# Altium project DC_ESC.PrjPcb
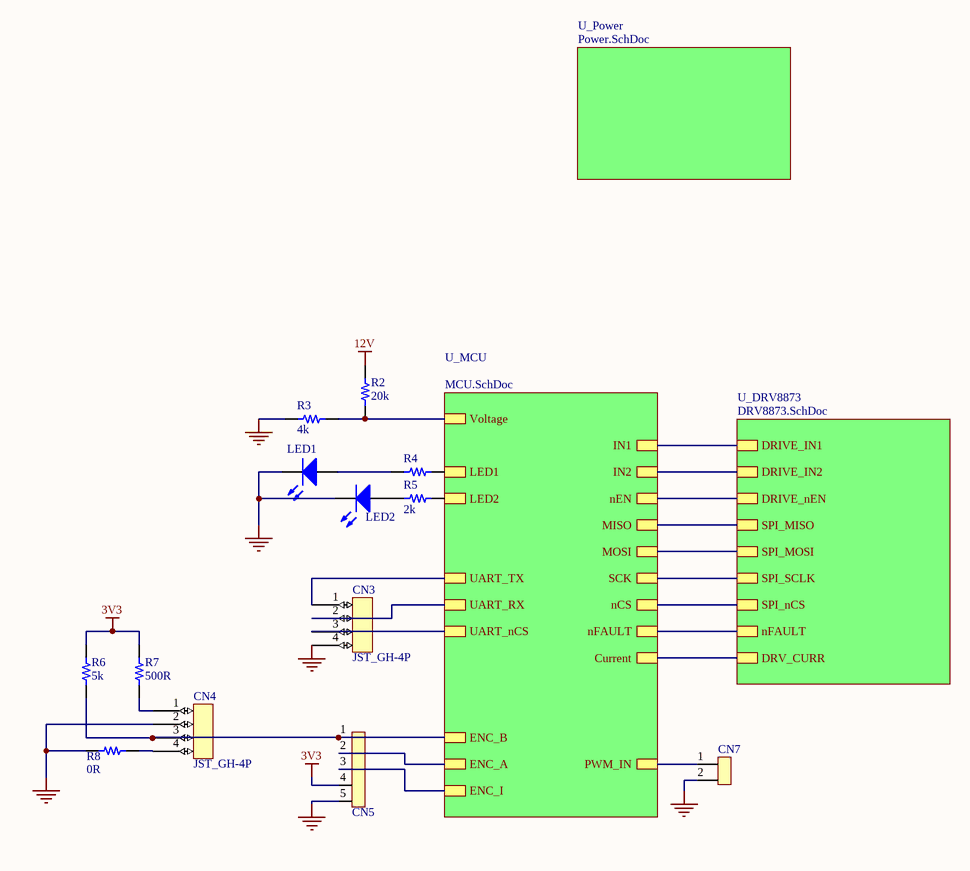
[diagram p0: ESC.SchDoc]
4 sheets, 34 parts. Net scope: hierarchical (ports join the sheet entries above them; power ports are global).
Board file: ESC.PcbDoc
Sheets:
  ESC.SchDoc
    U_MCU = MCU.SchDoc
    U_DRV8873 = DRV8873.SchDoc
    U_Power = Power.SchDoc

## Sheet ESC.SchDoc
size A3

### Parts
CN3  JST_GH-4P  [JST_GH-4P]
CN4  JST_GH-4P  [JST_GH-4P]
CN5  5P-2.5mm  [5-Pin-Header]  (value not drawn)
CN7  2P-2.5mm  [2.5mm-2P]  (value not drawn)
LED1  LED  [0805-LED]  (value not drawn)
LED2  LED  [0805-LED]  (value not drawn)
R2  20k  [0805 - duplicate]
R3  4k  [0805 - duplicate]
R4  4k  [0805 - duplicate]  (value not drawn)
R5  2k  [0805 - duplicate]
R6  5k  [0805 - duplicate]
R7  500R  [0805 - duplicate]
R8  0R  [0805 - duplicate]

### Sub-sheets
U_DRV8873 = DRV8873.SchDoc: DRIVE_IN1, DRIVE_IN2, DRIVE_nEN, SPI_MISO, SPI_MOSI, SPI_SCLK, SPI_nCS, nFAULT, DRV_CURR
U_MCU = MCU.SchDoc: LED1, LED2, MOSI, MISO, SCK, nCS, nEN, nFAULT, IN2, IN1, Voltage, Current, UART_TX, UART_RX, UART_nCS, ENC_B, ENC_A, ENC_I, PWM_IN
U_Power = Power.SchDoc: no entries

### Nets
3V3: CN5.4 R6.1 R7.1
12V: R2.2
GND: CN3.4 CN4.2 CN5.5 CN7.2 LED1.2(K) LED2.2(K) R3.2 R8.1
NetCN3_1: CN3.1 ; sheet U_MCU/UART_TX
NetCN3_2: CN3.2 ; sheet U_MCU/UART_RX
NetCN3_3: CN3.3 ; sheet U_MCU/UART_nCS
NetCN4_1: CN4.1 R7.2
NetCN4_3: CN4.3 CN5.1 R6.2 ; sheet U_MCU/ENC_B
NetCN4_4: CN4.4 R8.2
NetCN5_2: CN5.2 ; sheet U_MCU/ENC_A
NetCN5_3: CN5.3 ; sheet U_MCU/ENC_I
NetCN7_1: CN7.1 ; sheet U_MCU/PWM_IN
NetLED1_1: LED1.1(A) R4.2
NetLED2_1: LED2.1(A) R5.2
NetR2_1: R2.1 R3.1 ; sheet U_MCU/Voltage
NetR4_1: R4.1 ; sheet U_MCU/LED1
NetR5_1: R5.1 ; sheet U_MCU/LED2
NetR9_2: sheet U_MCU/Current, sheet U_DRV8873/DRV_CURR
NetU1_18: sheet U_MCU/IN1, sheet U_DRV8873/DRIVE_IN1
NetU1_19: sheet U_MCU/IN2, sheet U_DRV8873/DRIVE_IN2
NetU1_20: sheet U_MCU/nEN, sheet U_DRV8873/DRIVE_nEN
NetU1_21: sheet U_MCU/nFAULT, sheet U_DRV8873/nFAULT
NetU1_25: sheet U_MCU/nCS, sheet U_DRV8873/SPI_nCS
NetU1_26: sheet U_MCU/SCK, sheet U_DRV8873/SPI_SCLK
NetU1_27: sheet U_MCU/MISO, sheet U_DRV8873/SPI_MISO
NetU1_28: sheet U_MCU/MOSI, sheet U_DRV8873/SPI_MOSI

### Library data of the parts
R2-R8 = Resistor

## Sheet MCU.SchDoc
size A4
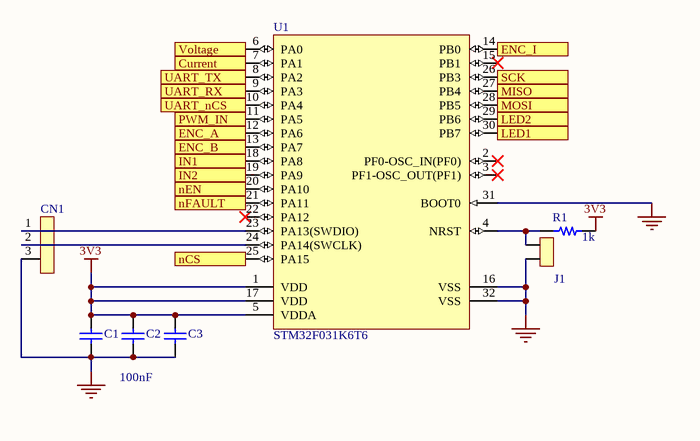
[diagram p1: MCU.SchDoc]

### Parts
C1  Cap  [0402]  (value not drawn)
C2  value 100nF  [0402]  (hidden comment: Cap)
C3  Cap  [0402]  (value not drawn)
CN1  3P-2.5mm  [2.5mm-3P]  (value not drawn)
J1  Jumper  [Jumper]  (value not drawn)
R1  1k  [0805 - duplicate]
U1  STM32F031K6T6  [STM-LQFP32_N]

### Ports
Current, ENC_A, ENC_B, ENC_I, IN1, IN2, LED1, LED2, MISO, MOSI, nCS, nEN, nFAULT, PWM_IN, SCK, UART_nCS, UART_RX, UART_TX, Voltage

### Nets
3V3: C1.2 C2.2 C3.2 R1.2 U1.1(VDD) U1.5(VDDA) U1.17(VDD)
GND: C1.1 C2.1 C3.1 CN1.3 J1.2 U1.16(VSS) U1.31(BOOT0) U1.32(VSS)
NetCN1_1: CN1.1 U1.23(PA13(SWDIO))
NetCN1_2: CN1.2 U1.24(PA14(SWCLK))
NetCN3_1: U1.8(PA2) ; port UART_TX
NetCN3_2: U1.9(PA3) ; port UART_RX
NetCN3_3: U1.10(PA4) ; port UART_nCS
NetCN4_3: U1.13(PA7) ; port ENC_B
NetCN5_2: U1.12(PA6) ; port ENC_A
NetCN5_3: U1.14(PB0) ; port ENC_I
NetCN7_1: U1.11(PA5) ; port PWM_IN
NetJ1_1: J1.1 R1.1 U1.4(NRST)
NetR2_1: U1.6(PA0) ; port Voltage
NetR4_1: U1.30(PB7) ; port LED1
NetR5_1: U1.29(PB6) ; port LED2
NetR9_2: U1.7(PA1) ; port Current
NetU1_18: U1.18(PA8) ; port IN1
NetU1_19: U1.19(PA9) ; port IN2
NetU1_20: U1.20(PA10) ; port nEN
NetU1_21: U1.21(PA11) ; port nFAULT
NetU1_25: U1.25(PA15) ; port nCS
NetU1_26: U1.26(PB3) ; port SCK
NetU1_27: U1.27(PB4) ; port MISO
NetU1_28: U1.28(PB5) ; port MOSI

Not connected (* = marked no-connect by the designer): U1 2(PF0-OSC_IN(PF0))* 3(PF1-OSC_OUT(PF1))* 15(PB1)* 22(PA12)*

### Library data of the parts
C1 C3 = Cap: Value: 100pF; Published: 8-Jun-2000; LatestRevisionDate: 17-Jul-2002; LatestRevisionNote: Re-released for DXP Platform.; PackageReference: RAD-0.3; Publisher: Altium Limited; PackageDescription: Radial Cap, Thru-Hole; 2 Leads; 0.3 in Pin Spacing
R1 = Resistor
U1 = CMP-0304-00091-2: ARM Cortex-M0 32-bit MCU, 32 KB Flash, 4 KB Internal RAM, 25 I/Os, 32-Pin LQFP, -40 to 85 degC, Tray; Manufacturer: STMicroelectronics; Operating Frequency(F) (Processor speed) (MHz): 48; Supply Voltage(Vcc) min (V): 2; Internal RAM Size (kB): 4; I/Os (High Current): 25; FLASH Size (Prog) (kB): 32; Package Description: 32-Pin Low Profile Quad Flat Package, 7 x 7 mm Body, 0.8 mm Pitch; Packing: Tray; Package Reference: LQFP32; ComponentLink2URL: http://www.st.com/st-web-ui/static/active/en/resource/technical/document/datasheet/DM00104043.pdf; ComponentLink2Description: Datasheet; ComponentLink1Description: Manufacturer URL; PartNumber: STM32F031K6T6; ComponentLink1URL: http://www.st.com/; Mounting Technology: Surface Mount; DatasheetVersion: Rev. 3; Core: ARM Cortex-M0
C2 = Cap: Published: 8-Jun-2000; LatestRevisionDate: 17-Jul-2002; LatestRevisionNote: Re-released for DXP Platform.; PackageReference: RAD-0.3; Publisher: Altium Limited; PackageDescription: Radial Cap, Thru-Hole; 2 Leads; 0.3 in Pin Spacing

## Sheet DRV8873.SchDoc
size A3
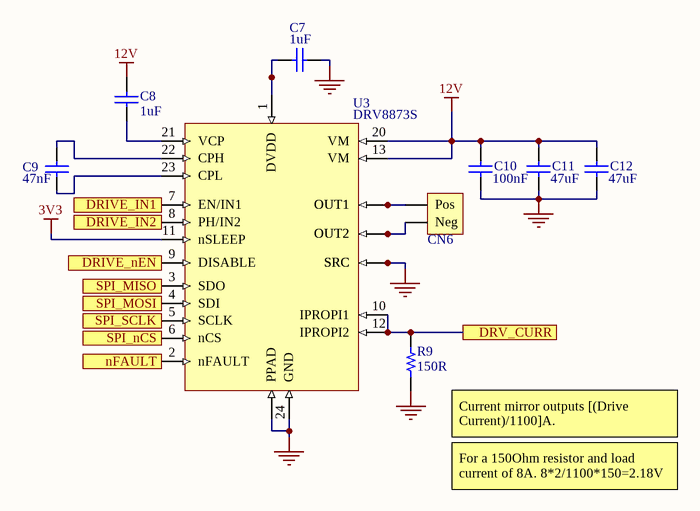
[diagram p2: DRV8873.SchDoc]

### Parts
C7  value 1uF  [0402]  (hidden comment: Cap)
C8  value 1uF  [0402]  (hidden comment: Cap)
C9  value 47nF  [0402]  (hidden comment: Cap)
C10  value 100nF  [0402]  (hidden comment: Cap)
C11  value 47uF  [1206]  (hidden comment: Cap)
C12  value 47uF  [1206]  (hidden comment: Cap)
CN6  JST_Leads_In  [Power_Leads]  (value not drawn)
R9  150R  [0805 - duplicate]
U3  DRV8873S  [HTSSOP24]

### Ports
DRIVE_IN1, DRIVE_IN2, DRIVE_nEN, DRV_CURR, nFAULT, SPI_MISO, SPI_MOSI, SPI_nCS, SPI_SCLK

### Nets
3V3: U3.11(nSLEEP)
12V: C8.2 C10.2 C11.2 C12.2 U3.13(VM) U3.20(VM)
GND: C7.2 C10.1 C11.1 C12.1 R9.1 U3.16(SRC) U3.17(SRC) U3.24(GND) U3.THERM(PPAD)
NetC7_1: C7.1 U3.1(DVDD)
NetC8_1: C8.1 U3.21(VCP)
NetC9_1: C9.1 U3.23(CPL)
NetC9_2: C9.2 U3.22(CPH)
NetCN6_A: CN6.A(Pos) U3.18(OUT1) U3.19(OUT1)
NetCN6_K: CN6.K(Neg) U3.14(OUT2) U3.15(OUT2)
NetR9_2: R9.2 U3.10(IPROPI1) U3.12(IPROPI2) ; port DRV_CURR
NetU1_18: U3.7(EN/IN1) ; port DRIVE_IN1
NetU1_19: U3.8(PH/IN2) ; port DRIVE_IN2
NetU1_20: U3.9(DISABLE) ; port DRIVE_nEN
NetU1_21: U3.2(nFAULT) ; port nFAULT
NetU1_25: U3.6(nCS) ; port SPI_nCS
NetU1_26: U3.5(SCLK) ; port SPI_SCLK
NetU1_27: U3.3(SDO) ; port SPI_MISO
NetU1_28: U3.4(SDI) ; port SPI_MOSI

### Notes on the sheet
- (near R9) Current mirror outputs [(Drive Current)/1100]A.
- For a 150Ohm resistor and load current of 8A. 8*2/1100*150=2.18V

### Library data of the parts
R9 = Resistor
C7-C12 = Cap: Published: 8-Jun-2000; LatestRevisionDate: 17-Jul-2002; LatestRevisionNote: Re-released for DXP Platform.; PackageReference: RAD-0.3; Publisher: Altium Limited; PackageDescription: Radial Cap, Thru-Hole; 2 Leads; 0.3 in Pin Spacing

## Sheet Power.SchDoc
size A4
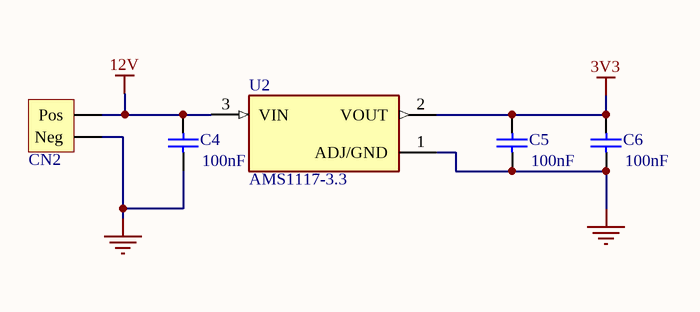
[diagram p3: Power.SchDoc]

### Parts
C4  value 100nF  [0402]  (hidden comment: Cap)
C5  value 100nF  [0402]  (hidden comment: Cap)
C6  value 100nF  [0402]  (hidden comment: Cap)
CN2  JST_Leads_In  [Power_Leads]  (value not drawn)
U2  AMS1117-3.3  [SOT229P700X180-4N]

### Nets
3V3: C5.2 C6.2 U2.2(VOUT)
12V: C4.2 CN2.A(Pos) U2.3(VIN)
GND: C4.1 C5.1 C6.1 CN2.K(Neg) U2.1(ADJ/GND)

### Library data of the parts
U2 = AMS1117-3.3: Sot223/Pkg 1-Amp 3.3-Volt Low Drop Out Voltage Regulatator; MF: Advanced Monolithic Systems; Price: None; Package: None; Value: *; MP: AMS1117-3.3; Availability: Unavailable; SnapEDA_Link: https://www.snapeda.com/parts/AMS1117-3.3/Advanced%20Monolithic%20Systems/view-part/53450/?ref=snap
C4-C6 = Cap: Published: 8-Jun-2000; LatestRevisionDate: 17-Jul-2002; LatestRevisionNote: Re-released for DXP Platform.; PackageReference: RAD-0.3; Publisher: Altium Limited; PackageDescription: Radial Cap, Thru-Hole; 2 Leads; 0.3 in Pin Spacing

## Nets that join several sheets
3V3: ESC (CN5.4 R6.1 R7.1), MCU (7 pins), DRV8873 (U3.11), Power (C5.2 C6.2 U2.2)
12V: ESC (R2.2), DRV8873 (6 pins), Power (C4.2 CN2.A U2.3)
GND: ESC (8 pins), MCU (8 pins), DRV8873 (9 pins), Power (5 pins)
NetCN3_1: ESC (CN3.1), MCU (U1.8)
NetCN3_2: ESC (CN3.2), MCU (U1.9)
NetCN3_3: ESC (CN3.3), MCU (U1.10)
NetCN4_3: ESC (CN4.3 CN5.1 R6.2), MCU (U1.13)
NetCN5_2: ESC (CN5.2), MCU (U1.12)
NetCN5_3: ESC (CN5.3), MCU (U1.14)
NetCN7_1: ESC (CN7.1), MCU (U1.11)
NetR2_1: ESC (R2.1 R3.1), MCU (U1.6)
NetR4_1: ESC (R4.1), MCU (U1.30)
NetR5_1: ESC (R5.1), MCU (U1.29)
NetR9_2: MCU (U1.7), DRV8873 (R9.2 U3.10 U3.12)
NetU1_18: MCU (U1.18), DRV8873 (U3.7)
NetU1_19: MCU (U1.19), DRV8873 (U3.8)
NetU1_20: MCU (U1.20), DRV8873 (U3.9)
NetU1_21: MCU (U1.21), DRV8873 (U3.2)
NetU1_25: MCU (U1.25), DRV8873 (U3.6)
NetU1_26: MCU (U1.26), DRV8873 (U3.5)
NetU1_27: MCU (U1.27), DRV8873 (U3.3)
NetU1_28: MCU (U1.28), DRV8873 (U3.4)